# EAGLE design mapleSDuino-V0.2_022-eagle7 (EAGLE 7.6.0)
MAPLE-CUx Large Version
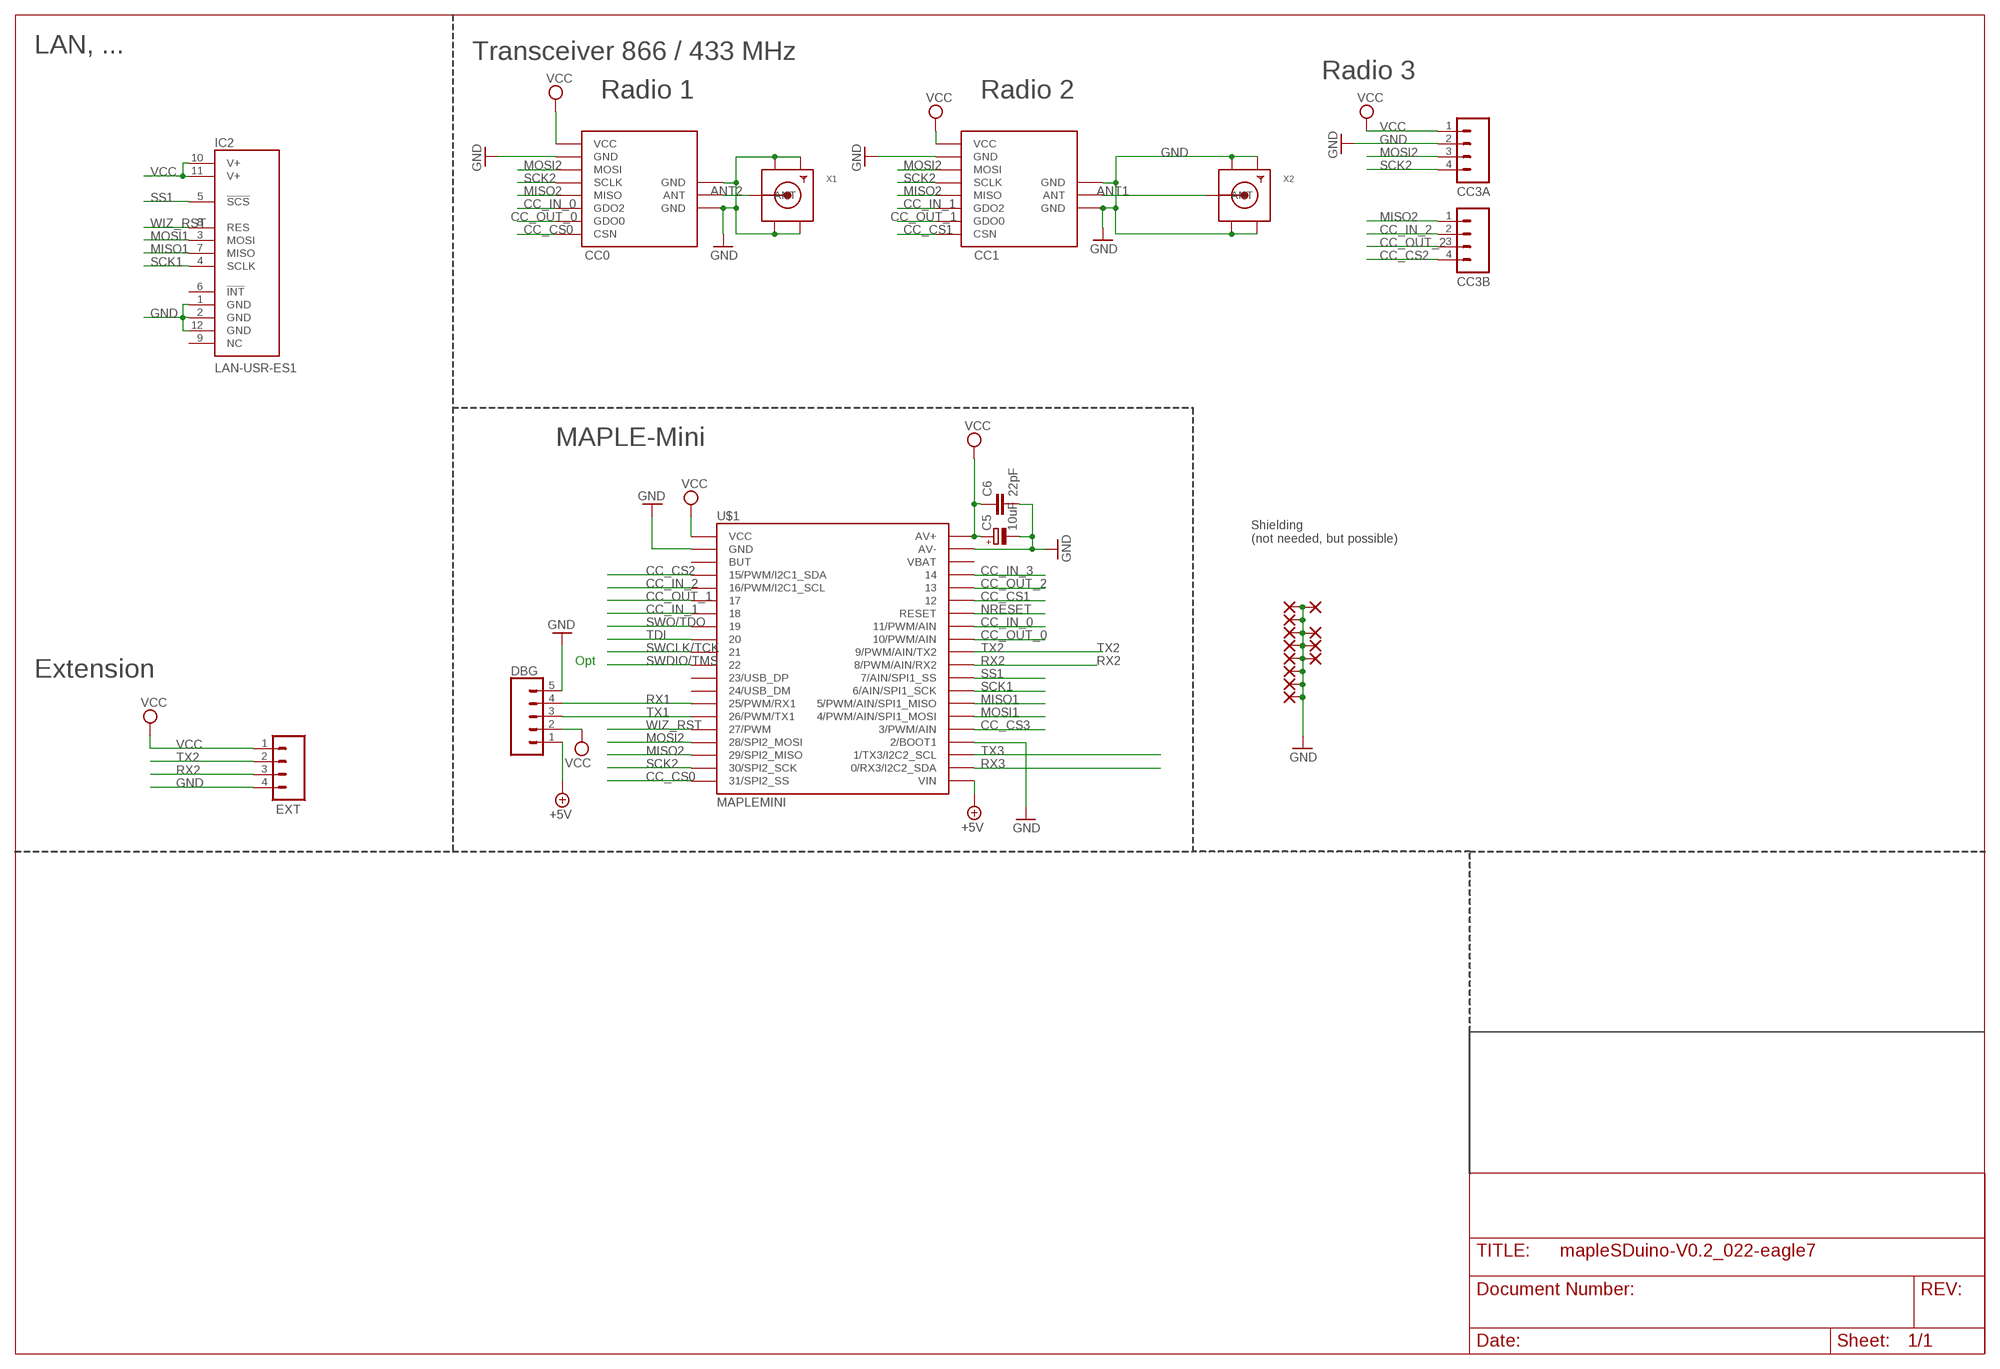
[diagram p0: schematic, sheet 1]

## Parts
C5  10uF  CPOL-EUR/2012-12W  [R/2012-12W]
C6  22pF  C-EUC0805  [C0805]
CC0  CC1101  CC1101_MODULE1SMD  [CC1101_MODULE1_SMD]
CC1  CC1101_MODULE1SMD  [CC1101_MODULE1_SMD]
CC3A  CONN_04PTH  [1X04]
CC3B  CONN_04PTH  [1X04]
DBG  CONN_05LOCK  [1X05_LOCK]
EXT  CONN_04PTH  [1X04]
IC2  LAN-USR-ES1  [USR-ES1]
PAD1  WIREPADSMD1,27-254  [SMD1,27-2,54]
PAD2  WIREPADSMD1,27-254  [SMD1,27-2,54]
PAD3  WIREPADSMD1,27-254  [SMD1,27-2,54]
PAD4  WIREPADSMD1,27-254  [SMD1,27-2,54]
PAD5  WIREPADSMD1,27-254  [SMD1,27-2,54]
PAD6  WIREPADSMD1,27-254  [SMD1,27-2,54]
PAD7  WIREPADSMD1,27-254  [SMD1,27-2,54]
PAD8  WIREPADSMD1,27-254  [SMD1,27-2,54]
PAD9  WIREPADSMD1,27-254  [SMD1,27-2,54]
PAD10  WIREPADSMD1,27-254  [SMD1,27-2,54]
PAD11  WIREPADSMD1,27-254  [SMD1,27-2,54]
PAD12  WIREPADSMD1,27-254  [SMD1,27-2,54]
U$1  MAPLEMINI  [20-DIP]
X1  SMACONNECTOR_EDGE  [SMA_EDGELAUNCH]
X2  SMACONNECTOR_EDGE  [SMA_EDGELAUNCH]

## Nets
+5V [PWR]: DBG.1 U$1.21(VIN)
ANT1 [PWR]: CC1.ANT X2.P(ANT)
ANT2: CC0.ANT X1.P(ANT)
CC_CS0: CC0.CSN U$1.20(31/SPI2_SS)
CC_CS1: CC1.CSN U$1.35
CC_CS2: CC3B.4 U$1.4(15/PWM/I2C1_SDA)
CC_CS3: U$1.25(3/PWM/AIN)
CC_IN_0: CC0.GDO2 U$1.33(11/PWM/AIN)
CC_IN_1: CC1.GDO2 U$1.7
CC_IN_2: CC3B.2 U$1.5(16/PWM/I2C1_SCL)
CC_IN_3: U$1.37
CC_OUT_0: CC0.GDO0 U$1.32(10/PWM/AIN)
CC_OUT_1: CC1.GDO0 U$1.6
CC_OUT_2: CC3B.3 U$1.36
GND [PWR]: C5.- C6.2 CC0.GND@0(GND) CC0.GND@1(GND) CC0.GND@2(GND) CC1.GND@0(GND) CC1.GND@1(GND) CC1.GND@2(GND) CC3A.2 DBG.5 EXT.4 IC2.1(GND) IC2.2(GND) IC2.12(GND) PAD1.1(P) PAD2.1(P) PAD3.1(P) PAD4.1(P) PAD5.1(P) PAD6.1(P) PAD7.1(P) PAD8.1(P) PAD9.1(P) PAD10.1(P) PAD11.1(P) PAD12.1(P) U$1.2(GND) U$1.24(2/BOOT1) U$1.39(AV-) X1.GND@1(GND4) X1.GND@2(GND3) X1.GND@3(GND2) X1.GND@4(GND1) X2.GND@1(GND4) X2.GND@2(GND3) X2.GND@3(GND2) X2.GND@4(GND1)
MISO1: IC2.7(MISO) U$1.27(5/PWM/AIN/SPI1_MISO)
MISO2: CC0.MISO CC1.MISO CC3B.1 U$1.18(29/SPI2_MISO)
MOSI1: IC2.3(MOSI) U$1.26(4/PWM/AIN/SPI1_MOSI)
MOSI2: CC0.MOSI CC1.MOSI CC3A.3 U$1.17(28/SPI2_MOSI)
NRESET: U$1.34(RESET)
RX1: DBG.4 U$1.14(25/PWM/RX1)
RX2: EXT.3 U$1.30(8/PWM/AIN/RX2)
RX3: U$1.22(0/RX3/I2C2_SDA)
SCK1: IC2.4(SCLK) U$1.28(6/AIN/SPI1_SCK)
SCK2: CC0.SCLK CC1.SCLK CC3A.4 U$1.19(30/SPI2_SCK)
SS1: IC2.5(!SCS!) U$1.29(7/AIN/SPI1_SS)
SWCLK/TCK: U$1.10
SWDIO/TMS: U$1.11
SWO/TDO: U$1.8
TDI: U$1.9
TX1: DBG.3 U$1.15(26/PWM/TX1)
TX2: EXT.2 U$1.31(9/PWM/AIN/TX2)
TX3: U$1.23(1/TX3/I2C2_SCL)
VCC [PWR]: C5.+ C6.1 CC0.VCC CC1.VCC CC3A.1 DBG.2 EXT.1 IC2.10(V+) IC2.11(V+) U$1.1(VCC) U$1.40(AV+)
WIZ_RST: IC2.8(RES) U$1.16(27/PWM)
Unconnected: IC2.6(!INT!) IC2.9(NC) U$1.3(BUT) U$1.12(23/USB_DP) U$1.13(24/USB_DM) U$1.38(VBAT)

## Notes on the sheet
- LAN, ... | Transceiver 866 / 433 MHz
- Radio 3
- Radio 1 | Radio 2
- MAPLE-Mini
- Shielding
  (not needed, but possible)
- Opt
- Extension

## Library data of the parts
C5 = rcl:CPOL-EU: POLARIZED CAPACITOR, European symbol
C6 = rcl:C-EU: CAPACITOR, European symbol
CC0 CC1 = wireless:CC1101_MODULE1: CC1101 wireless module for 433/868 MHz (sold from Aliexpress). DIL version for mounting with pin header (and SMD soldering) and SMD only variant available.
CC3A CC3B EXT = SparkFun-Connectors:CONN_04: Multi connection point. Often used as Generic Header-pin footprint for 0.1 inch spaced/style header connections On any of the 0.1 inch spaced packages, you can populate with these: Break Away Headers - Straight <https://www.sparkfun.com/products/116> (PRT-00116) Break Away Male Headers - Right Angle <https://www.sparkfun.com/products/553> (PRT-00553) Female Headers <https://www.sparkfun.com/products/115> (PRT-00115) Break Away Headers - Machine Pin <https://www.sparkfun.com/products/117> (PRT-00117) Break Away Female Headers - Swiss Machine Pin <https://www.sparkfun.com/products/743> (PRT-00743) For SCREWTERMINALS and SPRING TERMINALS visit here: Screw Terimnals on SparkFun.com <https://www.sparkfun.com/search/results?term=Screw+Terminals> (5mm/3.5mm/2.54mm spacing) This device is also useful as a general connection point to wire up your design to another part of your project. Our various solder wires solder well into these plated through hole pads. Hook-Up Wire - Assortment (Stranded, 22 AWG) <https://www.sparkfun.com/products/11375> (PRT-11375) Hook-Up Wire - Assortment (Solid Core, 22 AWG) <https://www.sparkfun.com/products/11367> (PRT-11367) View the entire wire category on our website here <https://www.sparkfun.com/categories/141> Special notes: Molex polarized connector foot print use with SKU : PRT-08231 with associated crimp pins and housings. 1MM SMD Version SKU: PRT-10208; PROD_ID: CONN-09696
DBG = SparkFun-Connectors:CONN_05: Multi connection point. Often used as Generic Header-pin footprint for 0.1 inch spaced/style header connections On any of the 0.1 inch spaced packages, you can populate with these: Break Away Headers - Straight <https://www.sparkfun.com/products/116> (PRT-00116) Break Away Male Headers - Right Angle <https://www.sparkfun.com/products/553> (PRT-00553) Female Headers <https://www.sparkfun.com/products/115> (PRT-00115) Break Away Headers - Machine Pin <https://www.sparkfun.com/products/117> (PRT-00117) Break Away Female Headers - Swiss Machine Pin <https://www.sparkfun.com/products/743> (PRT-00743) For SCREWTERMINALS and SPRING TERMINALS visit here: Screw Terimnals on SparkFun.com <https://www.sparkfun.com/search/results?term=Screw+Terminals> (5mm/3.5mm/2.54mm spacing) This device is also useful as a general connection point to wire up your design to another part of your project. Our various solder wires solder well into these plated through hole pads. Hook-Up Wire - Assortment (Stranded, 22 AWG) <https://www.sparkfun.com/products/11375> (PRT-11375) Hook-Up Wire - Assortment (Solid Core, 22 AWG) <https://www.sparkfun.com/products/11367> (PRT-11367) View the entire wire category on our website here <https://www.sparkfun.com/categories/141> Special notes: Molex polarized connector foot print use with SKU : PRT-08231 with associated crimp pins and housings. 1MM SMD Version SKU: PRT-10208
IC2 = Martin-Communication:LAN-USR-ES1
PAD1-PAD12 = wirepad:WIREPAD: Wire PAD connect wire on PCB
U$1 = maplemini-small:MAPLEMINI
X1 X2 = adafruit:SMACONNECTOR: SMA Connector 90° DIP SMA Connector, 50 Ohm (4UConnector: 07259)

## Net classes
0 default: width 0.305 mm
1 PWR: width 0.406 mm

## Board
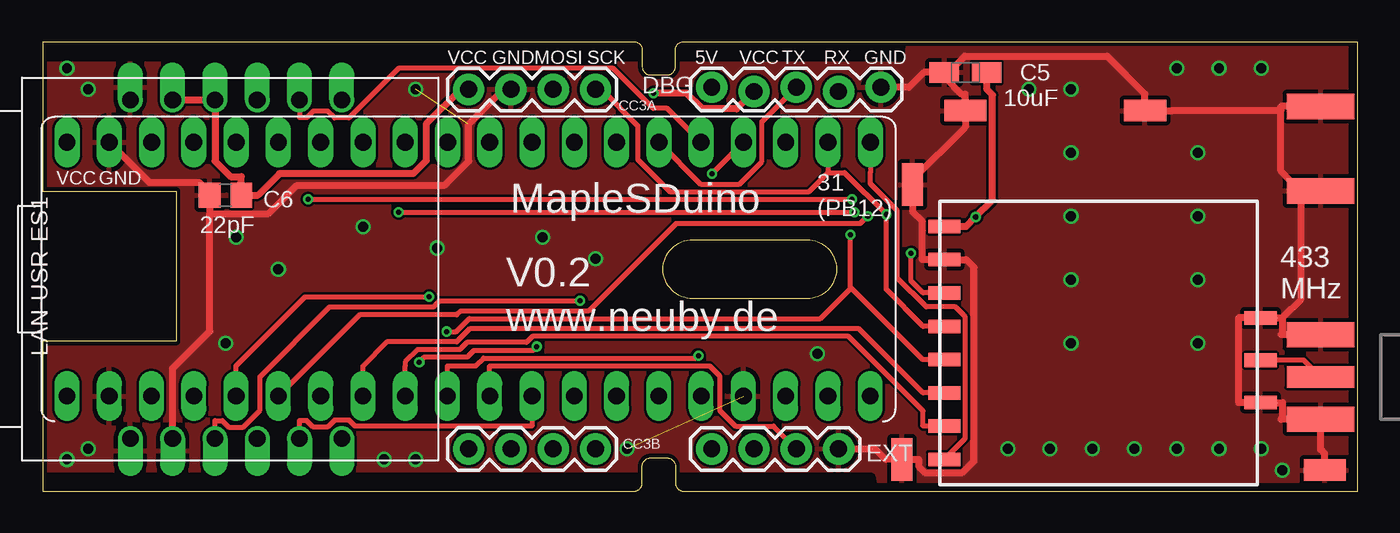
[diagram p1: board, top side]
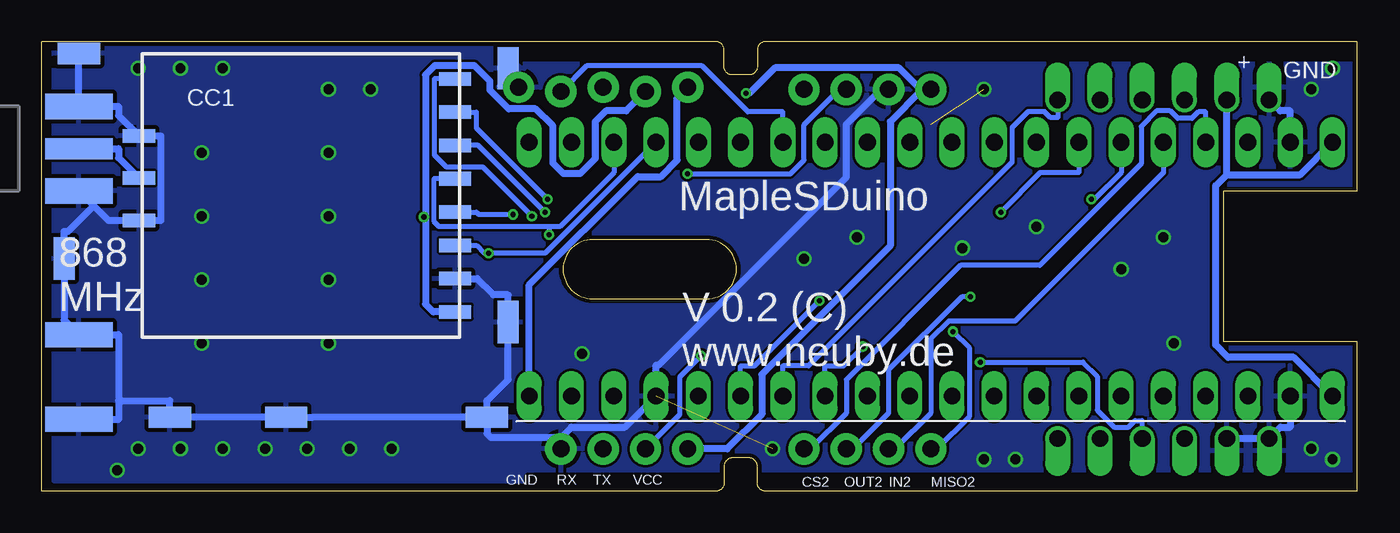
[diagram p2: board, bottom side, seen from below]

Size 79 x 27 mm. Coordinates in mm from the lower left corner, seen from the top.
Outline: 0,0 35.5,0 arc90 36,0.5 36,1.5 arc-90 36.5,2 37.5,2 arc-90 38,1.5 38,0.5 arc90 38.5,0 79,0 79,27 38.5,27 arc90 38,26.5 38,25.5 arc-90 37.5,25 36.5,25 arc-90 36,25.5 36,26.5 arc90 35.5,27 0,27 0,18 8,18 8,9 0,9 0,0
Outline: 39.04,15.11 45.9,15.11 arc-180 45.9,11.56 39.04,11.56 arc-180 39.04,15.11
Copper layers (1*16): Top 0.035mm / dielectric 1.5mm / Bottom 0.035mm
Design rules "Fusion_eagle_rule_v1.1": minimum track width 6mil, minimum drill 12mil, track to track 6mil, track to pad 6mil, pad to pad 6mil, via to via 6mil, smd to smd 0mil, copper to edge 10mil, drill to drill 10mil, minimum pad ring 10mil, minimum via ring 6mil, stop-mask expansion 2mil, vias tented up to drill 100mil, thermal gap 10mil
tRestrict: 8 lines
bRestrict: 8 lines

### Footprints (pad centres in the part's own frame; a part is rotated, then mirrored left to right if it is on the bottom)
R/2012-12W = smd 1.75 x 1.26: + 1.275,0; - -1.275,0
C0805 = smd 1.3 x 1.5: 1 -0.95,0; 2 0.95,0
CC1101_MODULE1_SMD = smd 1.93 x 0.813: ANT 19,5.96; CSN 0,0; GDO0 0,2; GDO2 0,4; GND@0 0,12; GND@1 19,8.5; GND@2 19,3.42; MISO 0,6; MOSI 0,10; SCLK 0,8; VCC 0,14
1X04 = drill 1.016 pad 1.88: 1 0,0; 2 2.54,0; 3 5.08,0; 4 7.62,0
1X05_LOCK = drill 1.016 pad 1.88: 1 0,0.127; 2 2.54,-0.127; 3 5.08,0.127; 4 7.62,-0.127; 5 10.16,0.127
USR-ES1 = drill 1 pad 1.35 offset: 1 -10.16,5.715; 2 -10.16,3.175; 3 -10.16,0.635; 4 -10.16,-1.905; 5 -10.16,-4.445; 6 -10.16,-6.985; 7 10.16,-6.985; 8 10.16,-4.445; 9 10.16,-1.905; 10 10.16,0.635; 11 10.16,3.175; 12 10.16,5.715
SMD1,27-2,54 = smd 1.27 x 2.54: 1 0,0
20-DIP = drill 1.016 pad 1.27 long: 1 -24.13,-7.62; 2 -21.59,-7.62; 3 -19.05,-7.62; 4 -16.51,-7.62; 5 -13.97,-7.62; 6 -11.43,-7.62; 7 -8.89,-7.62; 8 -6.35,-7.62; 9 -3.81,-7.62; 10 -1.27,-7.62; 11 1.27,-7.62; 12 3.81,-7.62; 13 6.35,-7.62; 14 8.89,-7.62; 15 11.43,-7.62; 16 13.97,-7.62; 17 16.51,-7.62; 18 19.05,-7.62; 19 21.59,-7.62; 20 24.13,-7.62 | drill 1 pad 1.27 long: 21 24.13,7.62; 22 21.59,7.62; 23 19.05,7.62; 24 16.51,7.62; 25 13.97,7.62; 26 11.43,7.62; 27 8.89,7.62; 28 6.35,7.62; 29 3.81,7.62; 30 1.27,7.62; 31 -1.27,7.62; 32 -3.81,7.62; 33 -6.35,7.62; 34 -8.89,7.62; 35 -11.43,7.62; 36 -13.97,7.62; 37 -16.51,7.62; 38 -19.05,7.62; 39 -21.59,7.62; 40 -24.13,7.62
SMA_EDGELAUNCH = smd 4.064 x 1.524: GND@1 2.032,-2.54; GND@2 2.032,2.54 | smd 4.064 x 1.524 bottom: GND@3 2.032,2.54; GND@4 2.032,-2.54 | smd 4.064 x 1.27: P 2.032,0

### Placement (x,y rotation side)
C5  55.42,25.15 0 top
C6  10.97,17.78 180 top
CC0  54.15,1.91 0 top
CC1  54.15,24.77 180 bottom
CC3A  25.57,24.13 0 top
CC3B  25.57,2.54 0 top
DBG  40.18,24.13 0 top
EXT  40.18,2.54 0 top
IC2  10.97,13.34 90 top
PAD1  52.24,18.41 0 top
PAD2  77.01,1.27 90 top
PAD3  55.42,22.86 90 top
PAD4  71.3,4.45 270 bottom
PAD5  66.22,22.86 90 top
PAD6  51.61,1.91 0 top
PAD7  64.31,4.45 270 bottom
PAD8  50.98,10.16 0 bottom
PAD9  76.76,26.29 270 bottom
PAD10  77.64,13.97 0 bottom
PAD11  52.24,4.45 270 bottom
PAD12  50.98,25.4 180 bottom
U$1  25.57,13.34 180 bottom
X1  78.79,6.86 180 top
X2  78.79,20.57 0 bottom

### Tracks (layer width: path | path; a pad name or v marks a point on that pad's centre or on a via)
+5V
  Bottom 0.406: U$1.21 49.7,12.39 43.2,18.89 41.8,18.89 40.81,19.88 40.81,23.62 DBG.1
ANT1
  Bottom 0.406: X2.P 74.37,20.57 74.37,20.02 CC1.ANT
ANT2
  Top 0.305: X1.P 75.75,7.87 CC0.ANT
CC_CS0
  Top 0.305: CC0.CSN 55.42,3.17 55.42,10.48 54.83,11.06 53.07,11.06 51.33,12.8 51.33,16.85 49.7,18.48 49.7,19.13 U$1.20
CC_CS1  (via drill 0.3 pad 0.61)
  Top 0.305: v49.55,16.52 49.1,16.07 38.02,16.07 32.78,10.82 25.09,10.82 24.87,10.59 19.02,10.59 U$1.35
  Bottom 0.305: v49.55,16.52 52.51,19.48 54.69,19.48 55.42,20.2 55.42,24.77 CC1.CSN
CC_CS2
  Bottom 0.305: U$1.4 9.06,22.78 9.51,22.78 9.9,22.39 10.75,22.39 11.2,22.84 12.02,22.84 12.93,21.92 12.93,19.66 19.03,13.56 23.79,13.56 30.66,6.7 30.66,4.69 32.8,2.54 CC3B.4
CC_IN_0
  Top 0.305: CC0.GDO2 52.88,5.91 49.03,9.76 25.64,9.76 24.85,8.96 20.66,8.96 19.23,7.53 U$1.33
CC_IN_1  (via drill 0.3 pad 0.61)
  Top 0.305: v21.38,16.76 v48.76,16.76
  Bottom 0.305: v21.38,16.76 19.02,19.13 16.68,19.13 U$1.7 | v48.76,16.76 52.77,20.77 CC1.GDO2
CC_IN_2
  Bottom 0.305: U$1.5 11.61,19.13 20.51,10.22 24.5,10.22 25.57,9.14 25.57,4.69 27.72,2.54 CC3B.2
CC_OUT_0
  Top 0.305: 29.05,8.93 29.41,9.3 48.41,9.3 52.88,4.83 52.88,3.9 CC0.GDO0 | 29.05,8.93 | 29.05,8.93 25.47,8.93 25.04,8.51 22.5,8.51 21.77,7.77 21.77,7.53 U$1.32
CC_OUT_1  (via drill 0.3 pad 0.61)
  Top 0.305: v15.93,17.53 v48.61,17.53
  Bottom 0.305: CC1.GDO0 52.88,22.77 52.88,21.8 v48.61,17.53 | v15.93,17.53 15.74,17.53 14.14,19.13 U$1.6
CC_OUT_2  (via drill 0.3 pad 0.61)
  Top 0.305: U$1.36 11.61,7.53 15.75,11.67 v23.21,11.67
  Bottom 0.305: v23.21,11.67 23.72,11.67 28.11,7.28 28.11,4.69 30.26,2.54 CC3B.3
GND  (via drill 0.6)  (2 unrouted)
  Top 0.406: 54.15,24.9 55.38,26.13 63.93,26.13 66.22,23.85 PAD5.1 67.84,22.86 74.37,22.86 | 54.15,24.9 55.19,23.85 55.42,23.85 PAD3.1 55.42,21.87 52.24,18.69 52.24,18.43 PAD1.1 52.24,16.79 52.83,16.2 52.83,13.9 CC0.GND@0 55.47,13.9 55.93,13.44 55.93,1.81 55.24,1.12 52.99,1.12 52.6,1.51 52.6,1.91 PAD6.1 50.62,1.91 49.98,2.54 EXT.4 | 54.15,24.9 C5.- 52.91,25.15 52.02,24.26 DBG.5 | 10.02,16.67 13.56,16.67 15.26,18.37 24.12,18.37 25.57,19.83 25.57,22.03 27.67,24.13 CC3A.2 | IC2.2 7.79,7.37 10.02,9.6 10.02,16.67 | 74.37,22.86 74.37,23.11 X2.GND@2 | 75.56,18.03 74.37,19.23 74.37,22.86 | 10.02,16.67 C6.2 10.02,17.92 9.41,18.53 6.41,18.53 U$1.2 | 74.47,10.4 74.47,9.5 74.37,9.4 X1.GND@1 | 74.47,10.4 CC0.GND@1 71.83,10.4 71.83,5.33 CC0.GND@2 74.47,5.33 74.47,4.42 74.37,4.32 X1.GND@2 76.76,2.52 77.01,2.26 77.01,1.35 PAD2.1 | 75.56,18.03 75.56,11.5 74.47,10.4 | X2.GND@1 75.56,18.03
  Bottom 0.406: CC3A.2 28.56,24.13 30.66,22.03 30.66,18.86 41.93,7.58 42.09,7.58 U$1.24 43.96,3.84 47.18,3.84 47.8,3.22 | U$1.2 3.99,22.84 4.59,22.84 IC2.12 | 47.8,3.22 52.01,3.22 52.24,3.45 PAD11.1 | 47.8,3.22 EXT.4 | PAD11.1 52.24,5.44 50.98,6.71 PAD8.1 50.98,11.79 51.85,11.79 52.83,12.77 CC1.GND@0 | PAD11.1 62.68,4.45 PAD7.1 PAD4.1 71.3,5.44 74.37,5.44 | 75.87,17.15 74.99,16.27 CC1.GND@1 71.83,16.27 71.83,21.34 CC1.GND@2 74.37,22.56 74.37,23.11 X2.GND@2 PAD9.1 | IC2.2 IC2.1 4.58,3.85 3.99,3.85 U$1.39 | DBG.5 50.98,24.89 PAD12.1 | 75.87,17.15 77.42,15.6 77.64,15.6 PAD10.1 77.64,10.29 X1.GND@1 74.37,9.4 74.37,5.44 | 75.87,17.15 X2.GND@1 | 74.37,5.44 74.37,4.32 X1.GND@2
  other vias: 1.45,25.4 2.71,24.13 1.45,1.91 2.71,2.54 20.5,1.91 22.4,1.91 10.97,8.89 11.61,15.24 14.14,13.34 19.23,15.88 23.67,14.61 30.02,15.24 33.2,13.97 46.53,8.26 57.96,2.54 60.5,2.54 63.04,2.54 65.58,2.54 68.12,2.54 70.66,2.54 73.2,2.54 74.47,1.27 59.23,24.13 61.77,24.13 68.12,25.4 70.66,25.4 73.2,25.4 61.77,20.32 61.77,16.51 61.77,12.7 61.77,8.89 69.39,8.89 69.39,12.7 69.39,16.51 69.39,20.32 35.1,2.54 22.4,24.13
  pour Top: 0.17,26.67 78.28,26.67 78.28,0.64 0.17,0.64
  pour Bottom: 0.17,26.67 78.28,26.67 78.28,0.64 0.17,0.64
MISO1
  Bottom 0.305: U$1.27 34.47,7.53 32.92,7.53 20.7,19.75 20.7,21.84 19.75,22.79 18.75,22.79 18.39,22.44 17.95,22.44 IC2.7
MISO2  (via drill 0.3 pad 0.61)
  Top 0.305: 48.51,12.17 v48.51,15.4 | 48.51,12.17 48.61,12.17 52.88,7.91 CC0.MISO | v24.25,9.59 24.83,9.59 25.61,10.36 46.71,10.36 48.51,12.17
  Bottom 0.305: 48.51,15.89 v48.51,15.4 | 48.51,15.89 55.12,15.89 55.42,16.19 55.42,18.77 CC1.MISO | 48.51,15.89 47.86,15.89 44.62,19.13 U$1.18 | CC3B.1 25.21,2.54 23.24,4.51 23.24,8.57 v24.25,9.59
MOSI1  (via drill 0.3 pad 0.61)
  Top 0.305: 23.83,11.43 23.46,11.06 17.22,11.06 13.04,6.88 13.04,4.87 12.02,3.85 11.16,3.85 10.77,4.23 10.34,4.23 IC2.3 | 23.83,11.43 | 23.83,11.43 v32.28,11.43
  Bottom 0.305: v32.28,11.43 36.18,7.53 37.01,7.53 U$1.26
MOSI2  (via drill 0.3 pad 0.61)
  Top 0.305: U$1.17 v40.19,19.06 | v52.16,14.3 52.16,12.63 52.88,11.9 CC0.MOSI
  Bottom 0.305: v40.19,19.06 34.02,19.06 33.2,19.88 33.2,21.99 31.06,24.13 CC3A.3 | U$1.17 48.74,14.3 v52.16,14.3 52.41,14.3 52.88,14.77 CC1.MOSI
RX1
  Bottom 0.305: U$1.14 34.47,22.78 36.56,22.78 39.33,25.55 46.26,25.55 DBG.4
RX2
  Top 0.305: EXT.3 43.9,3.9 41.6,3.9 40.65,4.85 40.65,6.92 40.05,7.53 26.84,7.53 U$1.30
SCK1  (via drill 0.3 pad 0.61)
  Top 0.305: v29.67,8.69 29.42,8.44 25.89,8.44 25.49,8.05 22.91,8.05 v22.61,7.75
  Bottom 0.305: v29.67,8.69 30.83,7.53 31.92,7.53 U$1.28 | IC2.4 12.88,4.23 13.31,4.23 13.7,3.85 14.56,3.85 15.58,4.87 15.58,6.89 16.43,7.75 v22.61,7.75
SCK2  (via drill 0.3 pad 0.61)
  Top 0.305: CC3A.4 33.56,24.13 35.73,21.96 35.73,19.93 37.67,17.99 46.03,17.99 47.16,19.13 | U$1.19 47.16,19.13 | 47.16,19.13 48.16,19.13 v50.67,16.62 50.67,12.12 52.88,9.9 CC0.SCLK
  Bottom 0.305: v50.67,16.62 52.73,16.62 52.88,16.77 CC1.SCLK
SS1
  Top 0.305: IC2.5 15.41,4.23 15.85,4.23 16.24,3.85 17.1,3.85 17.51,4.26 18.4,4.26 18.76,3.9 29.38,3.9 U$1.29
TX1
  Top 0.305: U$1.15 39.51,18.45 41.85,18.45 43.19,19.79 43.19,22.19 DBG.3
TX2  (via drill 0.3 pad 0.61)
  Top 0.305: v39.38,8.14 39.22,7.99 26.46,7.99 26,7.53 24.3,7.53 U$1.31
  Bottom 0.305: EXT.2 40.65,4.61 40.65,6.86 v39.38,8.14
VCC  (via drill 0.3 pad 0.61)
  Top 0.406: DBG.2 41.68,22.96 39.62,22.96 38.68,23.91 v36.68,23.91 | C5.+ 56.7,24.16 57.05,23.81 57.05,17.48 v56.03,16.47 55.47,15.9 CC0.VCC | IC2.11 IC2.10 10.34,19.83 11.28,18.89 11.92,18.89 C6.1 12.93,17.78 14.22,19.07 22.25,19.07 23.04,19.86 23.04,22.06 25.11,24.13 CC3A.1
  Bottom 0.406: 26.14,24.07 27.49,25.43 34.95,25.43 36.47,23.91 v36.68,23.91 | 26.14,24.07 28.01,22.2 28.01,14.74 35.73,7.01 35.73,4.62 37.82,2.54 EXT.1 | CC3A.1 26.08,24.13 26.14,24.07 | 55.94,16.47 55.94,11.23 55.47,10.77 CC1.VCC | DBG.2 43.89,22.84 45.1,22.84 45.74,22.2 45.74,19.98 46.65,19.07 47.65,19.07 48.28,19.7 48.28,21.93 49.31,22.96 50.95,22.96 52.07,24.08 52.07,24.62 53,25.56 55.38,25.56 55.94,25 55.94,16.47 | 55.94,16.47 v56.03,16.47 | 7.79,19.02 IC2.11 | U$1.40 3.77,8.04 7.72,8.04 8.47,8.79 8.47,18.35 7.79,19.02 | 7.79,19.02 3.38,19.02 U$1.1
WIZ_RST
  Top 0.305: IC2.8 15.41,22.44 15.85,22.44 16.24,22.82 17.11,22.82 17.52,22.41 18.39,22.41 21.37,25.39 34.26,25.39 36.65,22.99 37.51,22.99 U$1.16

### Text on the board
tNames: VCC | GND | MOSI | SCK | 5V | VCC | TX | RX | GND | C5 | 10uF | 31 / (PB12) | VCC | GND | C6 | 22pF | MapleSDuino | 433 / MHz | V0.2 / www.neuby.de | LAN-USR-ES1
bNames: + | GND | CC1 | MapleSDuino | 868 / MHz | V 0.2 (C) / www.neuby.de | MISO2 | IN2 | OUT2 | CS2 | VCC | TX | RX | GND